# EAGLE schematic MM_Main_new (EAGLE 7.1.0)
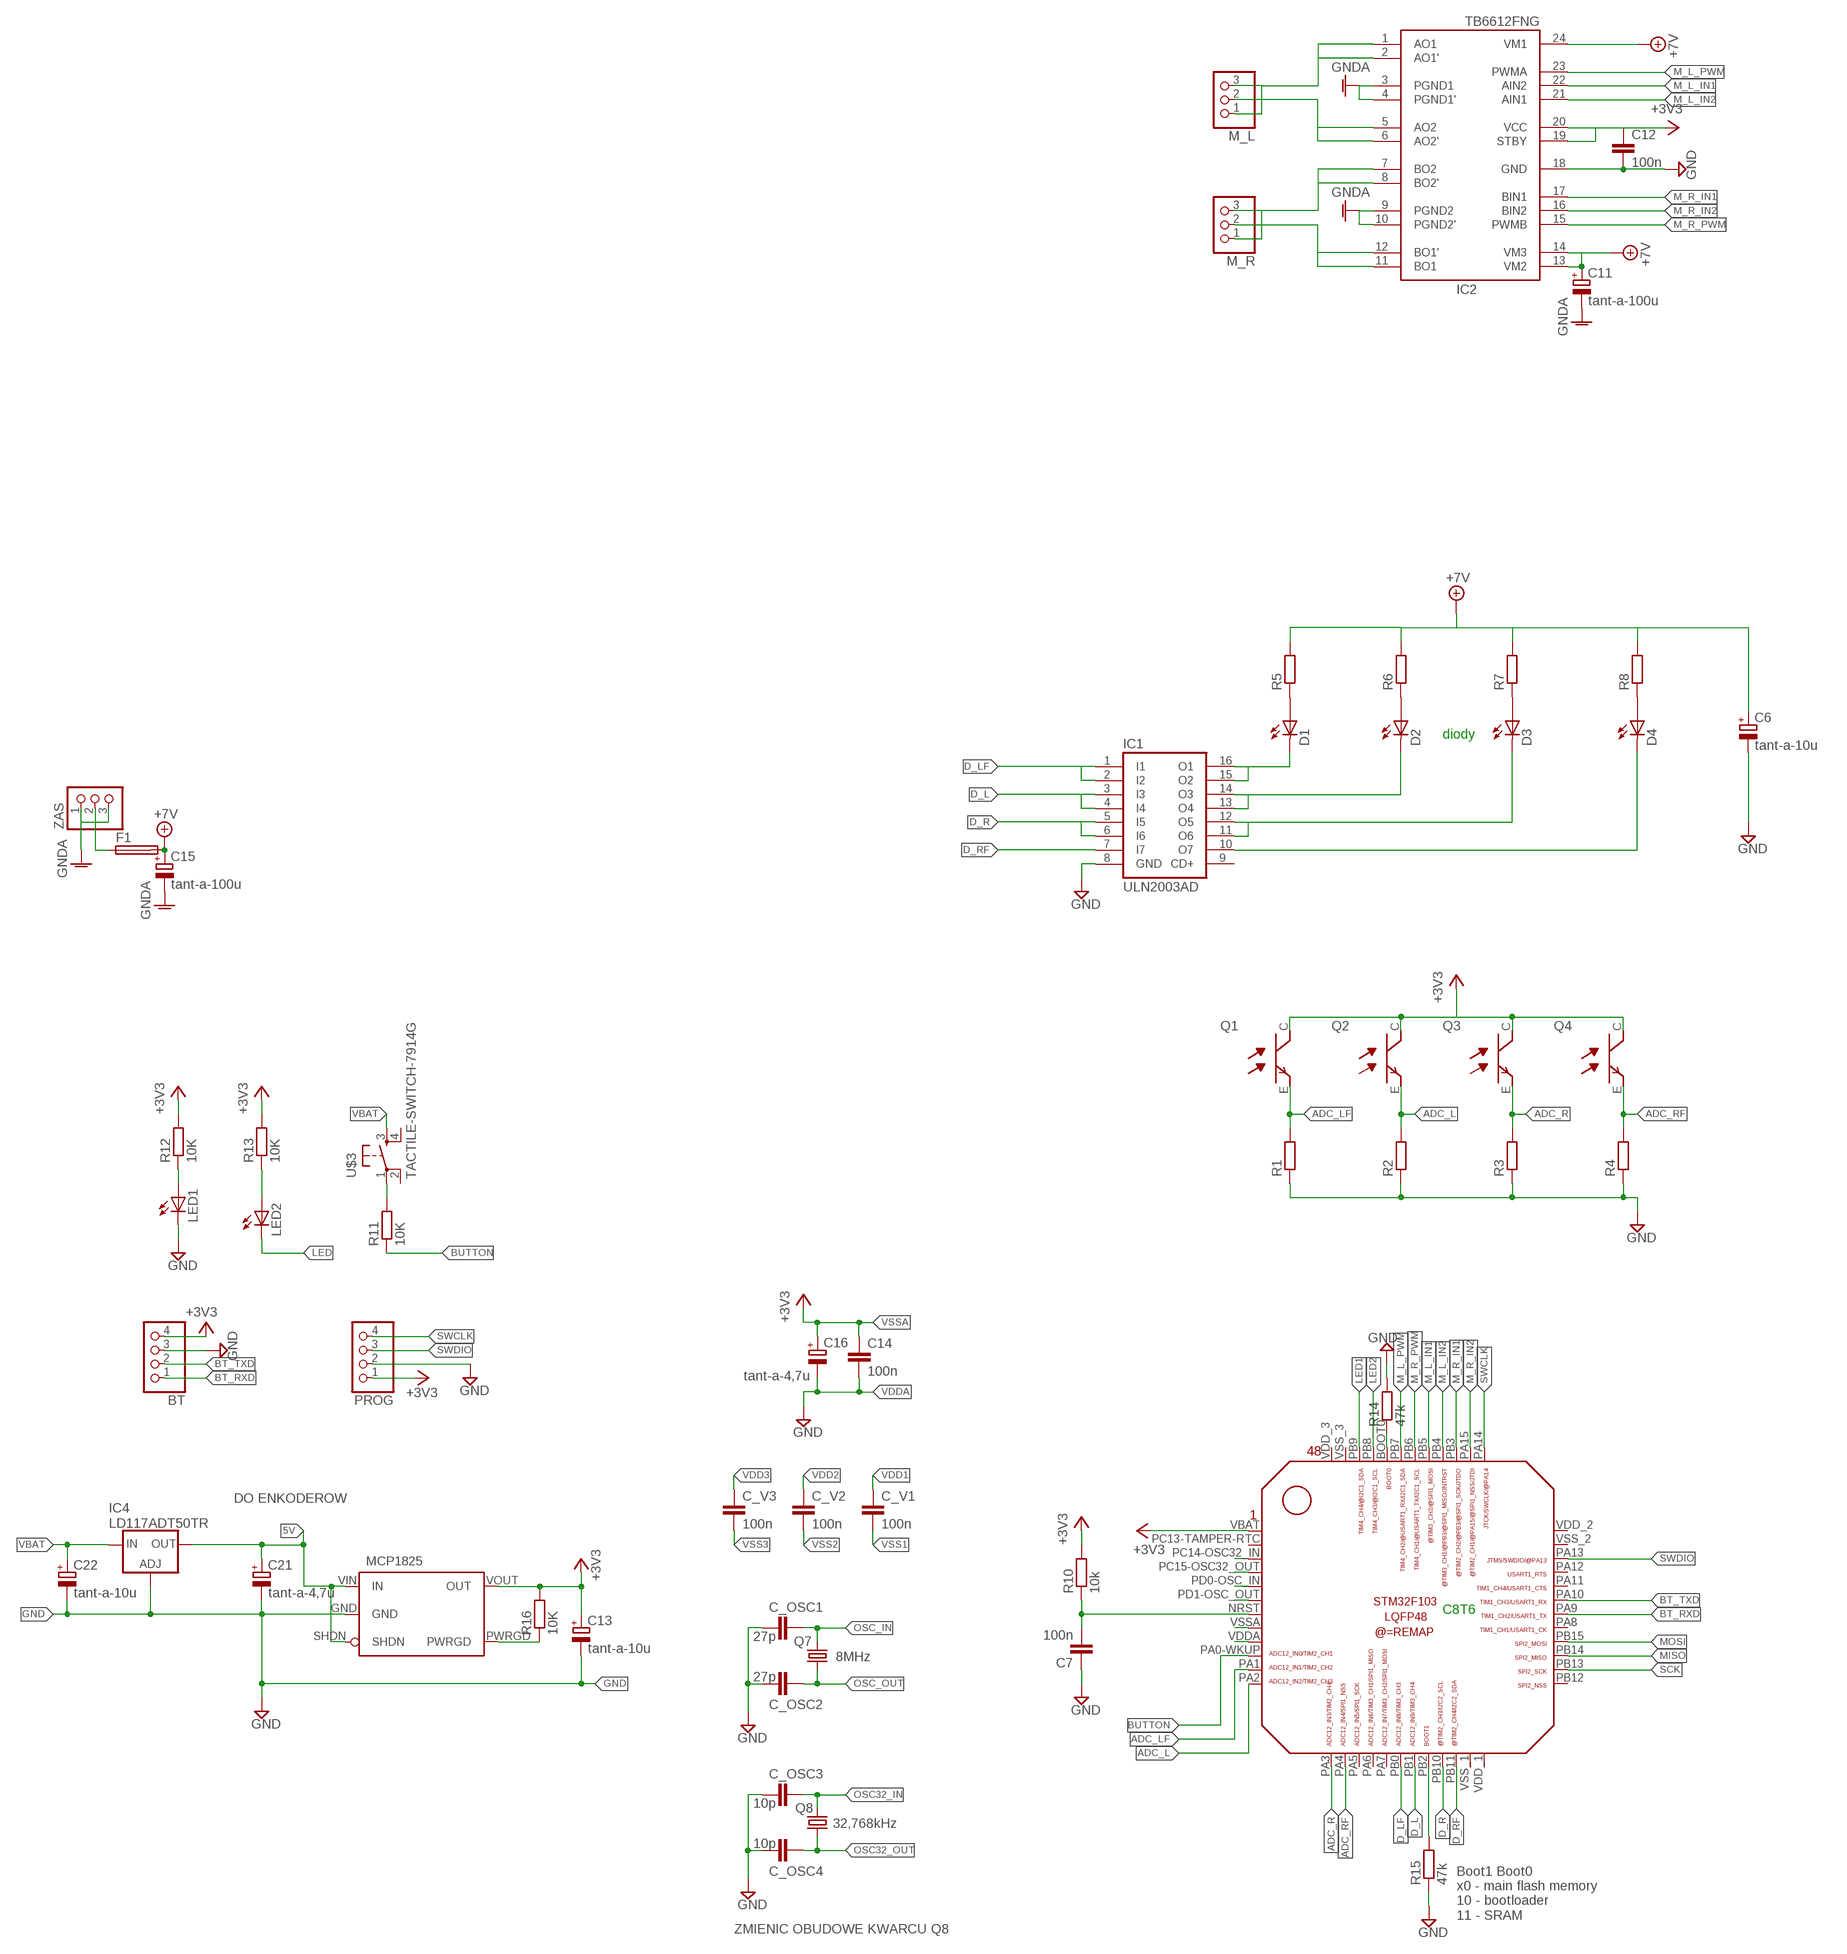
[diagram p0: schematic, sheet 1, part 1 of 2]
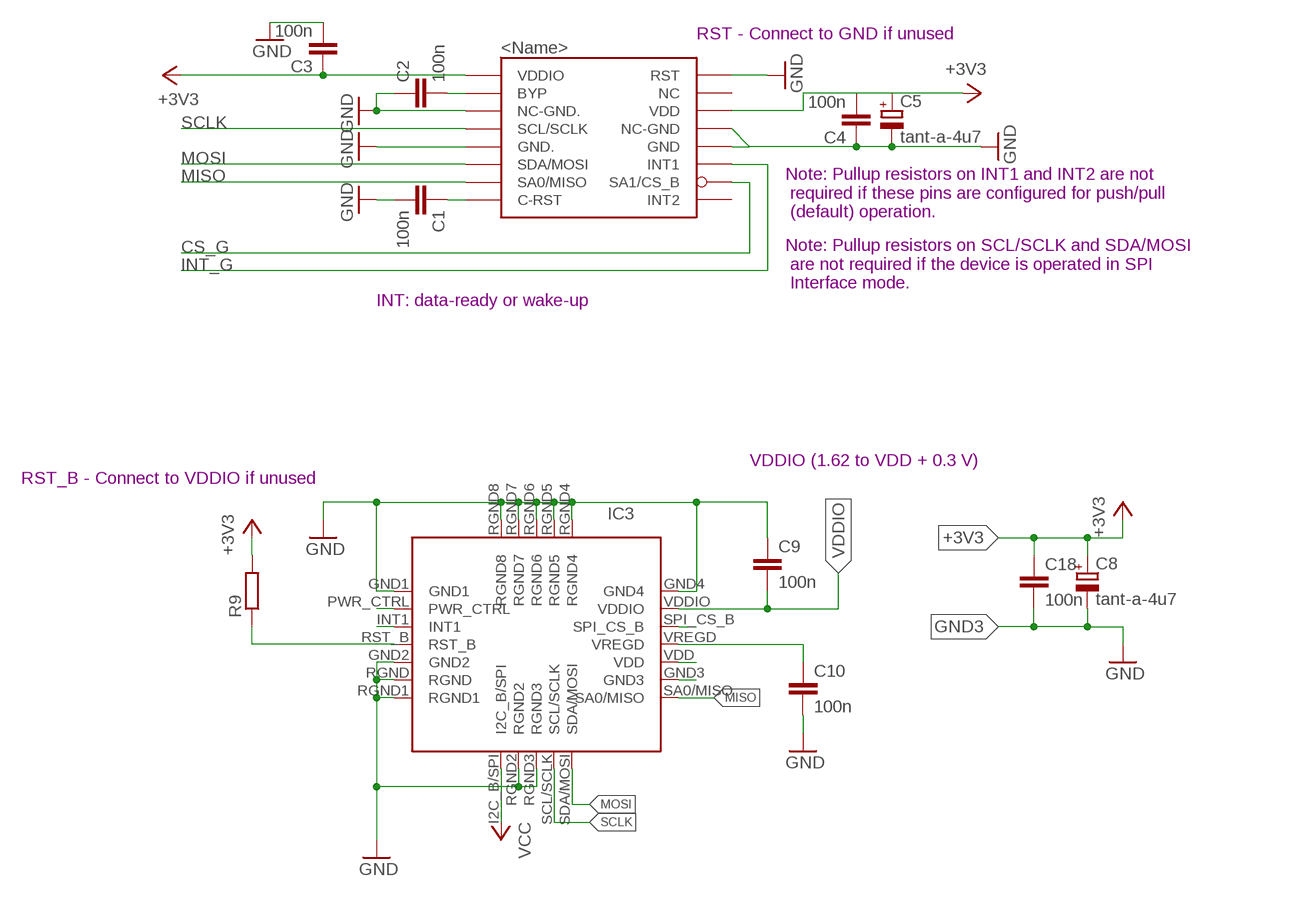
[diagram p1: schematic, sheet 1, part 2 of 2]

## Parts
BT  PINHD-1X4  [1X04]
C1  100n  C-EUC0603  [C0603]
C2  100n  C-EUC0603  [C0603]
C3  100n  C-EUC0603  [C0603]
C4  100n  C-EUC0603  [C0603]
C5  tant-a-4u7  CPOL-EUSMCA  [SMC_A]
C6  tant-a-10u  CPOL-EUSMCA  [SMC_A]
C7  100n  C-EUC0603  [C0603]
C8  tant-a-4u7  CPOL-EUSMCA  [SMC_A]
C9  100n  C-EUC0603  [C0603]
C10  100n  C-EUC0603  [C0603]
C11  tant-a-100u  CPOL-EUSMCA  [SMC_A]
C12  100n  C-EUC0603  [C0603]
C13  tant-a-10u  CPOL-EUSMCA  [SMC_A]
C14  100n  C-EUC0805  [C0805]
C15  tant-a-100u  CPOL-EUSMCA  [SMC_A]
C16  tant-a-4,7u  CPOL-EUSMCA  [SMC_A]
C18  100n  C-EUC0603  [C0603]
C21  tant-a-4,7u  CPOL-EUSMCA  [SMC_A]
C22  tant-a-10u  CPOL-EUSMCA  [SMC_A]
C_OSC1  27p  C-EUC0805  [C0805]
C_OSC2  27p  C-EUC0805  [C0805]
C_OSC3  10p  C-EUC0805  [C0805]
C_OSC4  10p  C-EUC0805  [C0805]
C_V1  100n  C-EUC0805  [C0805]
C_V2  100n  C-EUC0805  [C0805]
C_V3  100n  C-EUC0805  [C0805]
D1  SFH4545  [SFH4545]
D2  SFH4545  [SFH4545]
D3  SFH4545  [SFH4545]
D4  SFH4545  [SFH4545]
F1  GSH15  [GSH15]
IC1  ULN2003AD  [SO16]
IC2  TB6612FNG  [SSOP24]
IC3  FXAS21002C  [QFN24-4X4]
IC4  LD117ADT50TR  [DPACK]
LED1  LEDSML1206  [SML1206]
LED2  LEDSML1206  [SML1206]
M_L  PINHD-1X3  [1X03]
M_R  PINHD-1X3  [1X03]
PROG  PINHD-1X4  [1X04]
Q1  TEFT4300  [TEFT4300]
Q2  TEFT4300  [TEFT4300]
Q3  TEFT4300  [TEFT4300]
Q4  TEFT4300  [TEFT4300]
Q7  8MHz  CRYSTALHC49U70  [HC49U70]
Q8  32,768kHz  CRYSTALHC49U70  [HC49U70]
R1  R-EU_R0805  [R0805]
R2  R-EU_R0805  [R0805]
R3  R-EU_R0805  [R0805]
R4  R-EU_R0805  [R0805]
R5  R-EU_R0805  [R0805]
R6  R-EU_R0805  [R0805]
R7  R-EU_R0805  [R0805]
R8  R-EU_R0805  [R0805]
R9  R-EU_R0805  [R0805]
R10  10k  R-EU_R0805  [R0805]
R11  10K  R-EU_R0805  [R0805]
R12  10K  R-EU_R0805  [R0805]
R13  10K  R-EU_R0805  [R0805]
R14  47k  R-EU_R0805  [R0805]
R15  47k  R-EU_R0805  [R0805]
R16  10K  R-EU_R0805  [R0805]
U$1  STM32F103_LQFP48  [STM32F103_LQFP48]
U$2  FXOS8700CQR1  [QFN16-5X3]
U$3  TACTILE-SWITCH-7914G  [7914G]
U$4  MCP1825  [SOT223-5]
ZAS  PINHD-1X3  [1X03]

## Nets
5V: C21.+ IC4.4(OUT) U$4.SHDN U$4.VIN(IN)
+3V3: BT.4 C3.1 C4.2 C5.+ C8.+ C12.1 C13.+ C18.1 IC2.19(STBY) IC2.20(VCC) PROG.1 Q1.C Q2.C Q3.C Q4.C R9.2 R10.2 R12.2 R13.2 R16.2 U$1.VBAT U$2.P$1(VDDIO) U$2.P$14(VDD) U$4.VOUT(OUT)
+7V: C6.+ C11.+ C15.+ F1.2 IC2.13(VM2) IC2.14(VM3) IC2.24(VM1) R5.2 R6.2 R7.2 R8.2
ADC_L: Q2.E R2.2 U$1.PA2
ADC_LF: Q1.E R1.2 U$1.PA1
ADC_R: Q3.E R3.2 U$1.PA3
ADC_RF: Q4.E R4.2 U$1.PA4
BT_RXD: BT.1 U$1.PA9
BT_TXD: BT.2 U$1.PA10
BUTTON: R11.1 U$1.PA0-WKUP
CS_G: U$2.P$10(SA1/CS_B)
D_L: IC1.3(I3) IC1.4(I4) U$1.PB1
D_LF: IC1.1(I1) IC1.2(I2) U$1.PB0
D_R: IC1.5(I5) IC1.6(I6) U$1.PB10
D_RF: IC1.7(I7) U$1.PB11
GND: BT.3 C1.2 C2.1 C3.2 C4.1 C5.- C6.- C7.1 C9.1 C10.2 C12.2 C13.- C21.- C22.- C_OSC1.1 C_OSC2.1 C_OSC3.1 C_OSC4.1 IC1.8(GND) IC2.18(GND) IC3.GND1 IC3.GND2 IC3.GND4 IC3.RGND IC3.RGND1 IC3.RGND2 IC3.RGND3 IC3.RGND4 IC3.RGND5 IC3.RGND6 IC3.RGND7 IC3.RGND8 IC4.1(ADJ) LED1.C PROG.2 R1.1 R2.1 R3.1 R4.1 R14.2 R15.1 U$2.P$3(NC-GND.) U$2.P$5(GND.) U$2.P$12(GND) U$2.P$13(NC-GND) U$2.P$16(RST) U$4.GND
GND3: C8.- C18.2 IC3.GND3 ; supply symbol labelled GND
GNDA: C11.- C15.- IC2.3(PGND1) IC2.4(PGND1') IC2.9(PGND2) IC2.10(PGND2') ZAS.1 ZAS.3
INT_G: U$2.P$11(INT1)
LED: LED2.C
LED1: U$1.PB9
LED2: U$1.PB8
M_L_IN1: IC2.22(AIN2) U$1.PB5
M_L_IN2: IC2.21(AIN1) U$1.PB4
M_L_PWM: IC2.23(PWMA) U$1.PB7
M_R_IN1: IC2.17(BIN1) U$1.PB3
M_R_IN2: IC2.16(BIN2) U$1.PA15
M_R_PWM: IC2.15(PWMB) U$1.PB6
MISO: IC3.SA0/MISO U$1.PB14 U$2.P$7(SA0/MISO)
MOSI: IC3.SDA/MOSI U$1.PB15 U$2.P$6(SDA/MOSI)
N$1: R16.1 U$4.PWRGD
N$2: C7.2 R10.1 U$1.NRST
N$4: D1.+(A) R5.1
N$6: C1.1 U$2.P$8(C-RST)
N$7: C2.2 U$2.P$2(BYP)
N$9: IC2.1(AO1) IC2.2(AO1') M_L.1 M_L.3
N$10: D2.+(A) R6.1
N$11: D3.+(A) R7.1
N$12: D4.+(A) R8.1
N$13: D1.-(C) IC1.15(O2) IC1.16(O1)
N$14: D2.-(C) IC1.13(O4) IC1.14(O3)
N$15: D3.-(C) IC1.11(O6) IC1.12(O5)
N$16: D4.-(C) IC1.10(O7)
N$17: LED1.A R12.1
N$18: IC2.5(AO2) IC2.6(AO2') M_L.2
N$19: IC2.7(BO2) IC2.8(BO2') M_R.1 M_R.3
N$20: IC2.11(BO1) IC2.12(BO1') M_R.2
N$21: LED2.A R13.1
N$24: F1.1 ZAS.2
N$25: IC3.SPI_CS_B
N$26: C10.1 IC3.VREGD
N$27: IC3.PWR_CTRL
N$28: IC3.INT1
N$29: R11.2 U$3.1
N$30: IC3.RST_B R9.1
N$31: R14.1 U$1.BOOT0
N$33: R15.2 U$1.PB2
OSC32_IN: C_OSC3.2 Q8.2 U$1.PC14-OSC32_IN
OSC32_OUT: C_OSC4.2 Q8.1 U$1.PC15-OSC32_OUT(PC15-OSC_OUT)
OSC_IN: C_OSC1.2 Q7.2 U$1.PD0-OSC_IN
OSC_OUT: C_OSC2.2 Q7.1 U$1.PD1-OSC_OUT
SCK: U$1.PB13
SCLK: IC3.SCL/SCLK U$2.P$4(SCL/SCLK)
SWCLK: PROG.4 U$1.PA14
SWDIO: PROG.3 U$1.PA13
VBAT: C22.+ IC4.3(IN) U$3.3
VCC: IC3.I2C_B/SPI
VDD: IC3.VDD
VDD1: C_V1.1
VDD2: C_V2.1
VDD3: C_V3.1
VDDA: C14.2 C16.- U$1.VDDA ; supply symbol labelled GND
VDDIO: C9.2 IC3.VDDIO
VSS1: C_V1.2
VSS2: C_V2.2
VSS3: C_V3.2
VSSA: C14.1 C16.+ U$1.VSSA ; supply symbol labelled +3V3
Unconnected: IC1.9(CD+) U$1.PA5 U$1.PA6 U$1.PA7 U$1.PA8 U$1.PA11 U$1.PA12 U$1.PB12 U$1.PC13-TAMPER-RTC U$1.VDD_1 U$1.VDD_2 U$1.VDD_3 U$1.VSS_1 U$1.VSS_2 U$1.VSS_3 U$2.P$9(INT2) U$2.P$15(NC) U$3.2 U$3.4

## Notes on the sheet
- diody
- RST - Connect to GND if unused
- Note: Pullup resistors on INT1 and INT2 are not
   required if these pins are configured for push/pull
   (default) operation.
- Note: Pullup resistors on SCL/SCLK and SDA/MOSI
   are not required if the device is operated in SPI
   Interface mode.
- INT: data-ready or wake-up
- VDDIO (1.62 to VDD + 0.3 V)
- RST_B - Connect to VDDIO if unused
- DO ENKODEROW
- C8T6
- Boot1 Boot0
  x0 - main flash memory
  10 - bootloader
  11 - SRAM
- ZMIENIC OBUDOWE KWARCU Q8

## Library data of the parts
BT PROG = pinhead:PINHD-1X4: PIN HEADER
C1-C4 C7 C9 C10 C12 C14 C18 C_OSC1-C_OSC4 C_V1-C_V3 = rcl:C-EU: CAPACITOR, European symbol
C5 C6 C8 C11 C13 C15 C16 C21 C22 = rcl:CPOL-EU: POLARIZED CAPACITOR, European symbol
D1-D4 = _microMouse:SFH4545
F1 = fuse:GSH15: FUSE HOLDER grid 15mm, 19649 Wickmann; MPN: 64900001039; OC_FARNELL: 1271673; OC_NEWARK: 02P0318
IC1 = uln-udn:ULN2003A: DRIVER ARRAY
IC2 = _microMouse:TB6612FNG: TB6612FNG MOS dual H-bridge motor driver, 1.2A current 3.2A peak 3 or 5v logic and 3-15v motor
IC3 = _microMouse:FXAS21002C
IC4 = v-reg:LD117A?*: Low drop fixed and adjustable positive voltage regulators 1 A Source: http://www.st.com/stonline/products/literature/ds/7194/ld1117axx.pdf
LED1 LED2 = led:LED: LED OSRAM: - CHIPLED LG R971, LG N971, LY N971, LG Q971, LY Q971, LO R971, LY R971 LH N974, LH R974 LS Q976, LO Q976, LY Q976 LO Q996 - Hyper CHIPLED LW Q18S LB Q993, LB Q99A, LB R99A - SideLED LS A670, LO A670, LY A670, LG A670, LP A670 LB A673, LV A673, LT A673, LW A673 LH A674 LY A675 LS A676, LA A676, LO A676, LY A676, LW A676 LS A679, LY A679, LG A679 - Hyper Micro SIDELED® LS Y876, LA Y876, LO Y876, LY Y876 LT Y87S - SmartLED LW L88C, LW L88S LB L89C, LB L89S, LG L890 LS L89K, LO L89K, LY L89K LS L896, LA L896, LO L896, LY L896 - TOPLED LS T670, LO T670, LY T670, LG T670, LP T670 LSG T670, LSP T670, LSY T670, LOP T670, LYG T670 LG T671, LOG T671, LSG T671 LB T673, LV T673, LT T673, LW T673 LH T674 LS T676, LA T676, LO T676, LY T676, LB T676, LH T676, LSB T676, LW T676 LB T67C, LV T67C, LT T67C, LS T67K, LO T67K, LY T67K, LW E67C LS E67B, LA E67B, LO E67B, LY E67B, LB E67C, LV E67C, LT E67C LW T67C LS T679, LY T679, LG T679 LS T770, LO T770, LY T770, LG T770, LP T770 LB T773, LV T773, LT T773, LW T773 LH T774 LS E675, LA E675, LY E675, LS T675 LS T776, LA T776, LO T776, LY T776, LB T776 LHGB T686 LT T68C, LB T68C - Hyper Mini TOPLED® LB M676 - Mini TOPLED Santana® LG M470 LS M47K, LO M47K, LY M47K Source: http://www.osram.convergy.de LUXEON: - LUMILED® LXK2-PW12-R00, LXK2-PW12-S00, LXK2-PW14-U00, LXK2-PW14-V00 LXK2-PM12-R00, LXK2-PM12-S00, LXK2-PM14-U00 LXK2-PE12-Q00, LXK2-PE12-R00, LXK2-PE12-S00, LXK2-PE14-T00, LXK2-PE14-U00 LXK2-PB12-K00, LXK2-PB12-L00, LXK2-PB12-M00, LXK2-PB14-N00, LXK2-PB14-P00, LXK2-PB14-Q00 LXK2-PR12-L00, LXK2-PR12-M00, LXK2-PR14-Q00, LXK2-PR14-R00 LXK2-PD12-Q00, LXK2-PD12-R00, LXK2-PD12-S00 LXK2-PH12-R00, LXK2-PH12-S00 LXK2-PL12-P00, LXK2-PL12-Q00, LXK2-PL12-R00 Source: www.luxeon.com KINGBRIGHT: KA-3528ASYC Source: www.kingbright.com
M_L M_R ZAS = pinhead:PINHD-1X3: PIN HEADER
Q1-Q4 = _MM:TEFT4300
Q7 Q8 = crystal:CRYSTAL: CRYSTAL; OC_FARNELL: unknown; OC_NEWARK: unknown
R1-R9 = rcl:R-EU_: RESISTOR, European symbol
R10-R16 = resistor:R-EU_: RESISTOR, European symbol
U$1 = STM32F10x F4xx:STM32F103_LQFP48
U$2 = _microMouse:FXOS8700CQ: 6D 6axis sensor - 3D accelerator and 3D magnetometer
U$3 = GeekAmmo:TACTILE-SWITCH: Tactile Switch 4 Pins, SPST NO
U$4 = _microMouse:MCP1825